# EAGLE design LilyPad_Protoboard_Large (EAGLE 7.2.0)
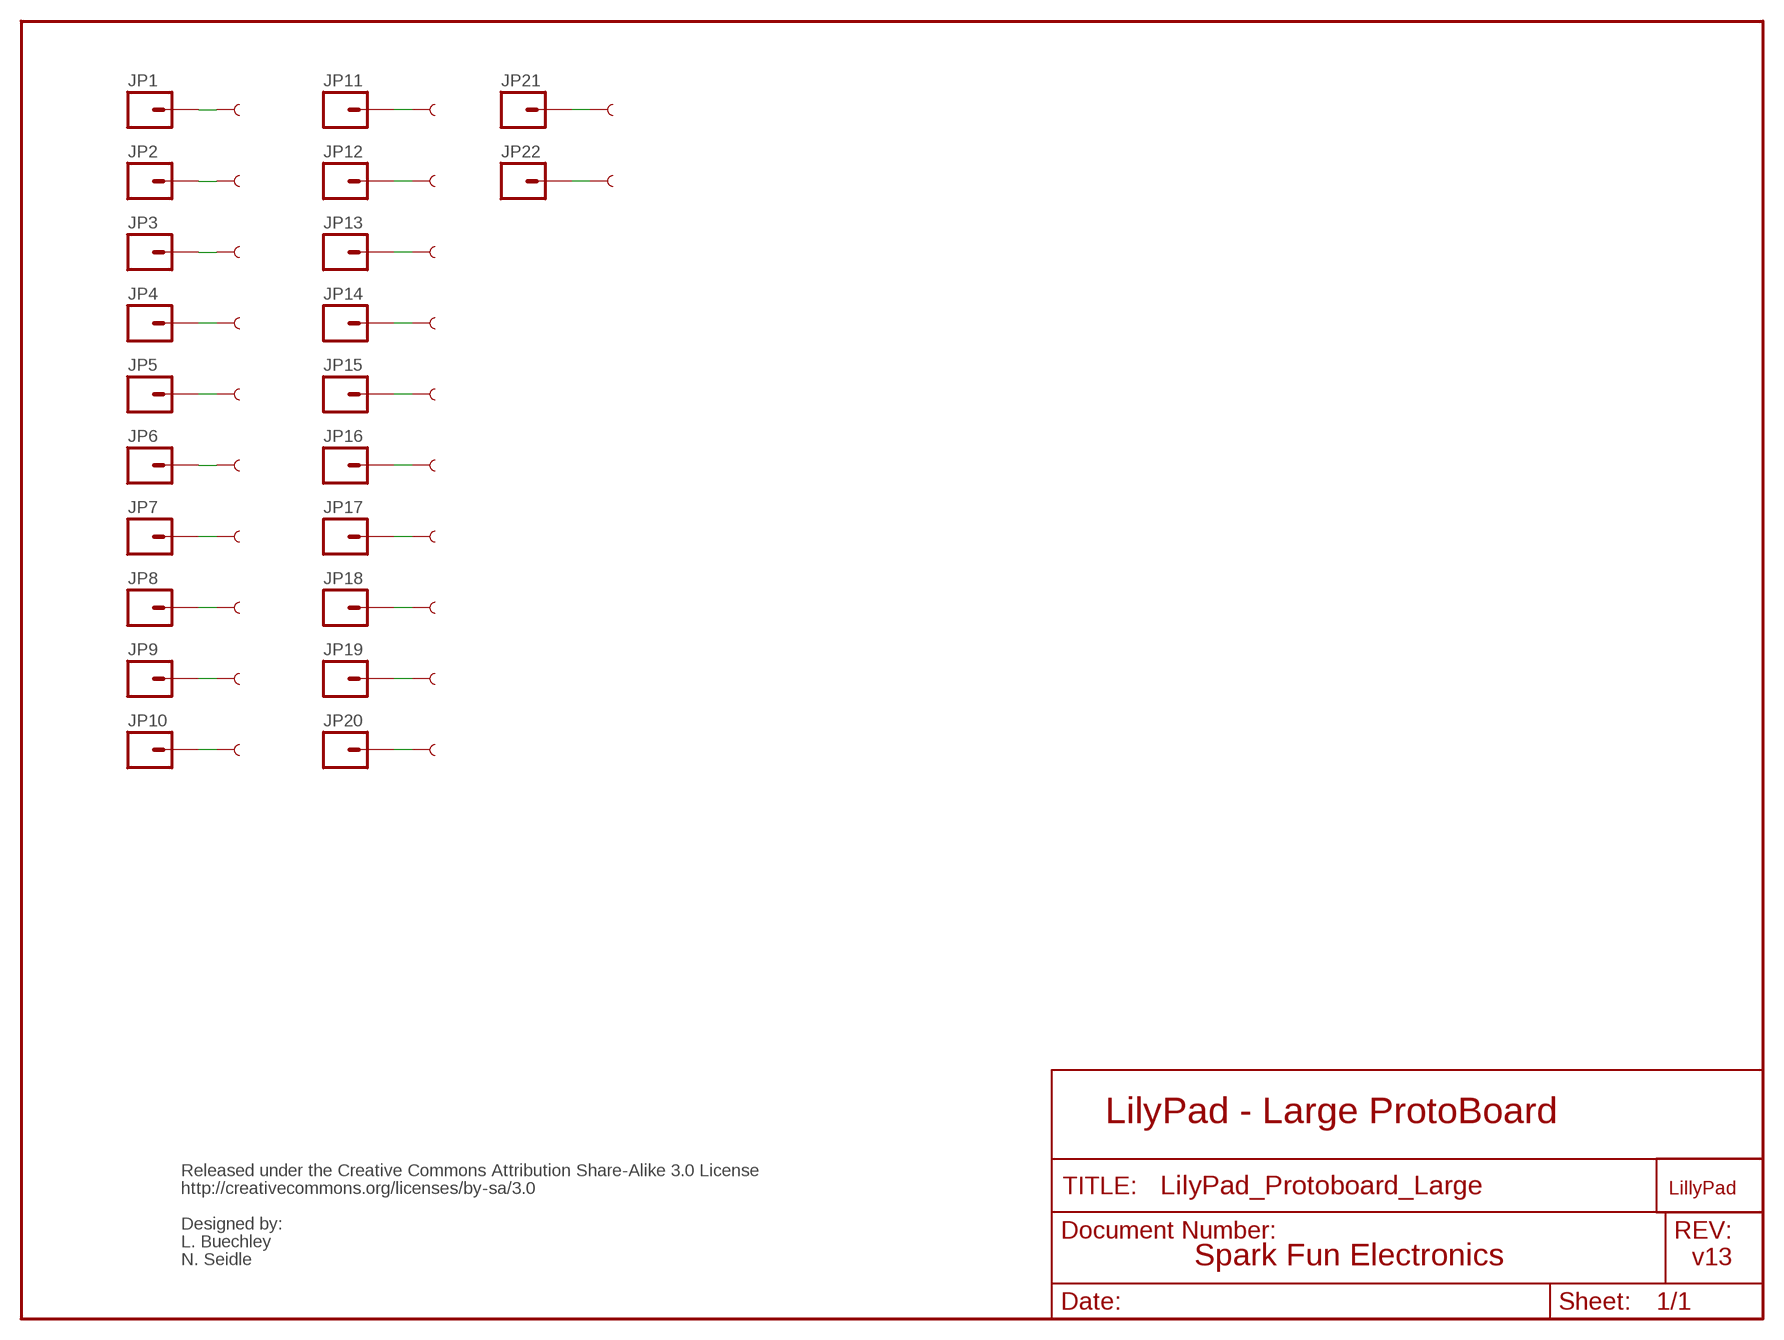
[diagram p0: schematic, sheet 1]

## Parts
GND  SEWTAP9  [PETAL-LONG-1-2SIDE]
JP1  M01SMDNS  [1X01NS]
JP2  M01SMDNS  [1X01NS]
JP3  M01SMDNS  [1X01NS]
JP4  M01SMDNS  [1X01NS]
JP5  M01SMDNS  [1X01NS]
JP6  M01SMDNS  [1X01NS]
JP7  M01SMDNS  [1X01NS]
JP8  M01SMDNS  [1X01NS]
JP9  M01SMDNS  [1X01NS]
JP10  M01SMDNS  [1X01NS]
JP11  M01SMDNS  [1X01NS]
JP12  M01SMDNS  [1X01NS]
JP13  M01SMDNS  [1X01NS]
JP14  M01SMDNS  [1X01NS]
JP15  M01SMDNS  [1X01NS]
JP16  M01SMDNS  [1X01NS]
JP17  M01SMDNS  [1X01NS]
JP18  M01SMDNS  [1X01NS]
JP19  M01SMDNS  [1X01NS]
JP20  M01SMDNS  [1X01NS]
JP21  M01SMDNS  [1X01NS]
JP22  M01SMDNS  [1X01NS]
U$2  LOGO-LPL  [LOGO-L]
U$4  SEWTAP9  [PETAL-LONG-1-2SIDE]
U$30  SEWTAP9  [PETAL-LONG-1-2SIDE]
U$31  SEWTAP9  [PETAL-LONG-1-2SIDE]
U$32  SEWTAP9  [PETAL-LONG-1-2SIDE]
U$33  SEWTAP9  [PETAL-LONG-1-2SIDE]
U$34  SEWTAP9  [PETAL-LONG-1-2SIDE]
U$35  SEWTAP9  [PETAL-LONG-1-2SIDE]
U$36  SEWTAP9  [PETAL-LONG-1-2SIDE]
U$37  SEWTAP9  [PETAL-LONG-1-2SIDE]
U$38  SEWTAP9  [PETAL-LONG-1-2SIDE]
U$39  SEWTAP9  [PETAL-LONG-1-2SIDE]
U$40  SEWTAP9  [PETAL-LONG-1-2SIDE]
U$41  SEWTAP9  [PETAL-LONG-1-2SIDE]
U$42  SEWTAP9  [PETAL-LONG-1-2SIDE]
U$43  SEWTAP9  [PETAL-LONG-1-2SIDE]
U$44  SEWTAP9  [PETAL-LONG-1-2SIDE]
U$45  SEWTAP9  [PETAL-LONG-1-2SIDE]
U$46  SEWTAP9  [PETAL-LONG-1-2SIDE]
U$47  SEWTAP9  [PETAL-LONG-1-2SIDE]
U$48  SEWTAP9  [PETAL-LONG-1-2SIDE]
U$51  SEWTAP9  [PETAL-LONG-1-2SIDE]

## Nets
ALLNET: GND.1 JP1.1 JP2.1 JP3.1 JP4.1 JP5.1 JP6.1 JP7.1 JP8.1 JP9.1 JP10.1 JP11.1 JP12.1 JP13.1 JP14.1 JP15.1 JP16.1 JP17.1 JP18.1 JP19.1 JP20.1 JP21.1 JP22.1 U$4.1 U$30.1 U$31.1 U$32.1 U$33.1 U$34.1 U$35.1 U$36.1 U$37.1 U$38.1 U$39.1 U$40.1 U$41.1 U$42.1 U$43.1 U$44.1 U$45.1 U$46.1 U$47.1 U$48.1 U$51.1

## Notes on the sheet
- LilyPad - Large ProtoBoard
- Released under the Creative Commons Attribution Share-Alike 3.0 License
- http://creativecommons.org/licenses/by-sa/3.0
- Designed by:
- L. Buechley
- N. Seidle | Spark Fun Electronics | v13

## Library data of the parts
GND U$4 U$30-U$48 U$51 = LilyPad-Wearables:SEWTAP
JP1-JP22 = SparkFun:M01: Header 1 Standard 1-pin 0.1" header. Use with straight break away headers (SKU : PRT-00116), right angle break away headers (PRT-00553), swiss pins (PRT-00743), machine pins (PRT-00117), and female headers (PRT-00115).
U$2 = LilyPad-Wearables:LOGO-LP

## Net classes
0 Default: width 0.203 mm
1 VCC: width 0.305 mm

## Board
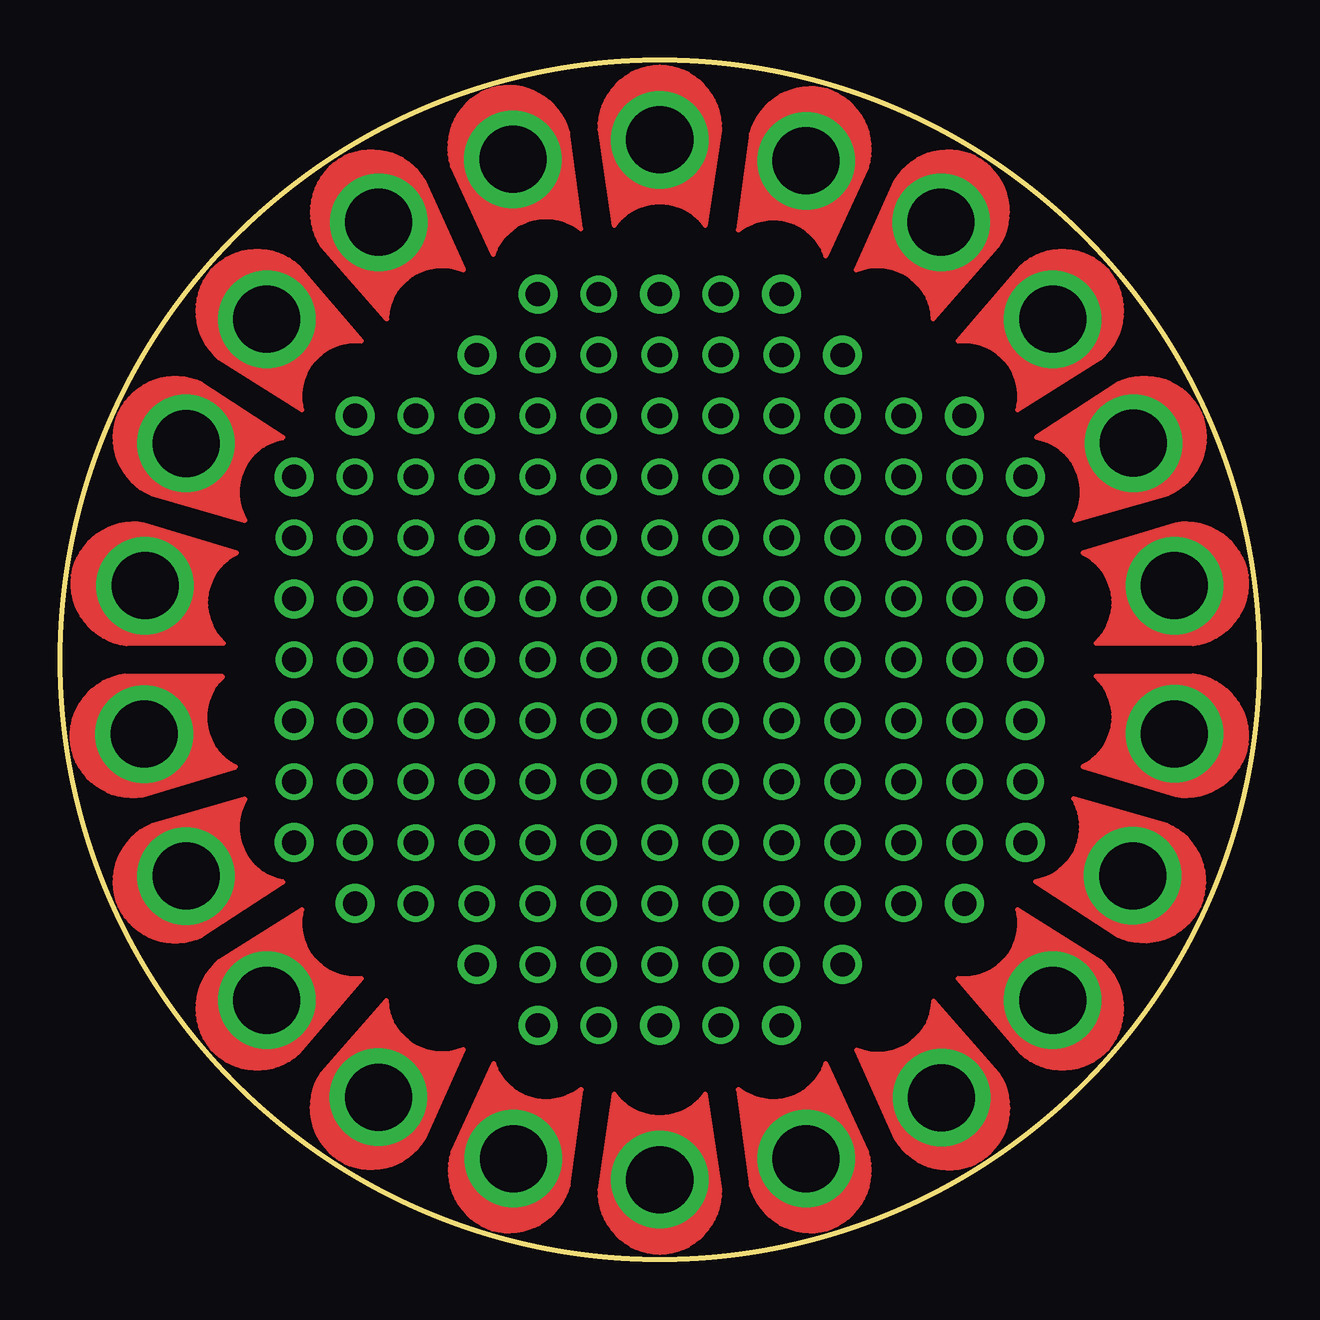
[diagram p1: board, top side]
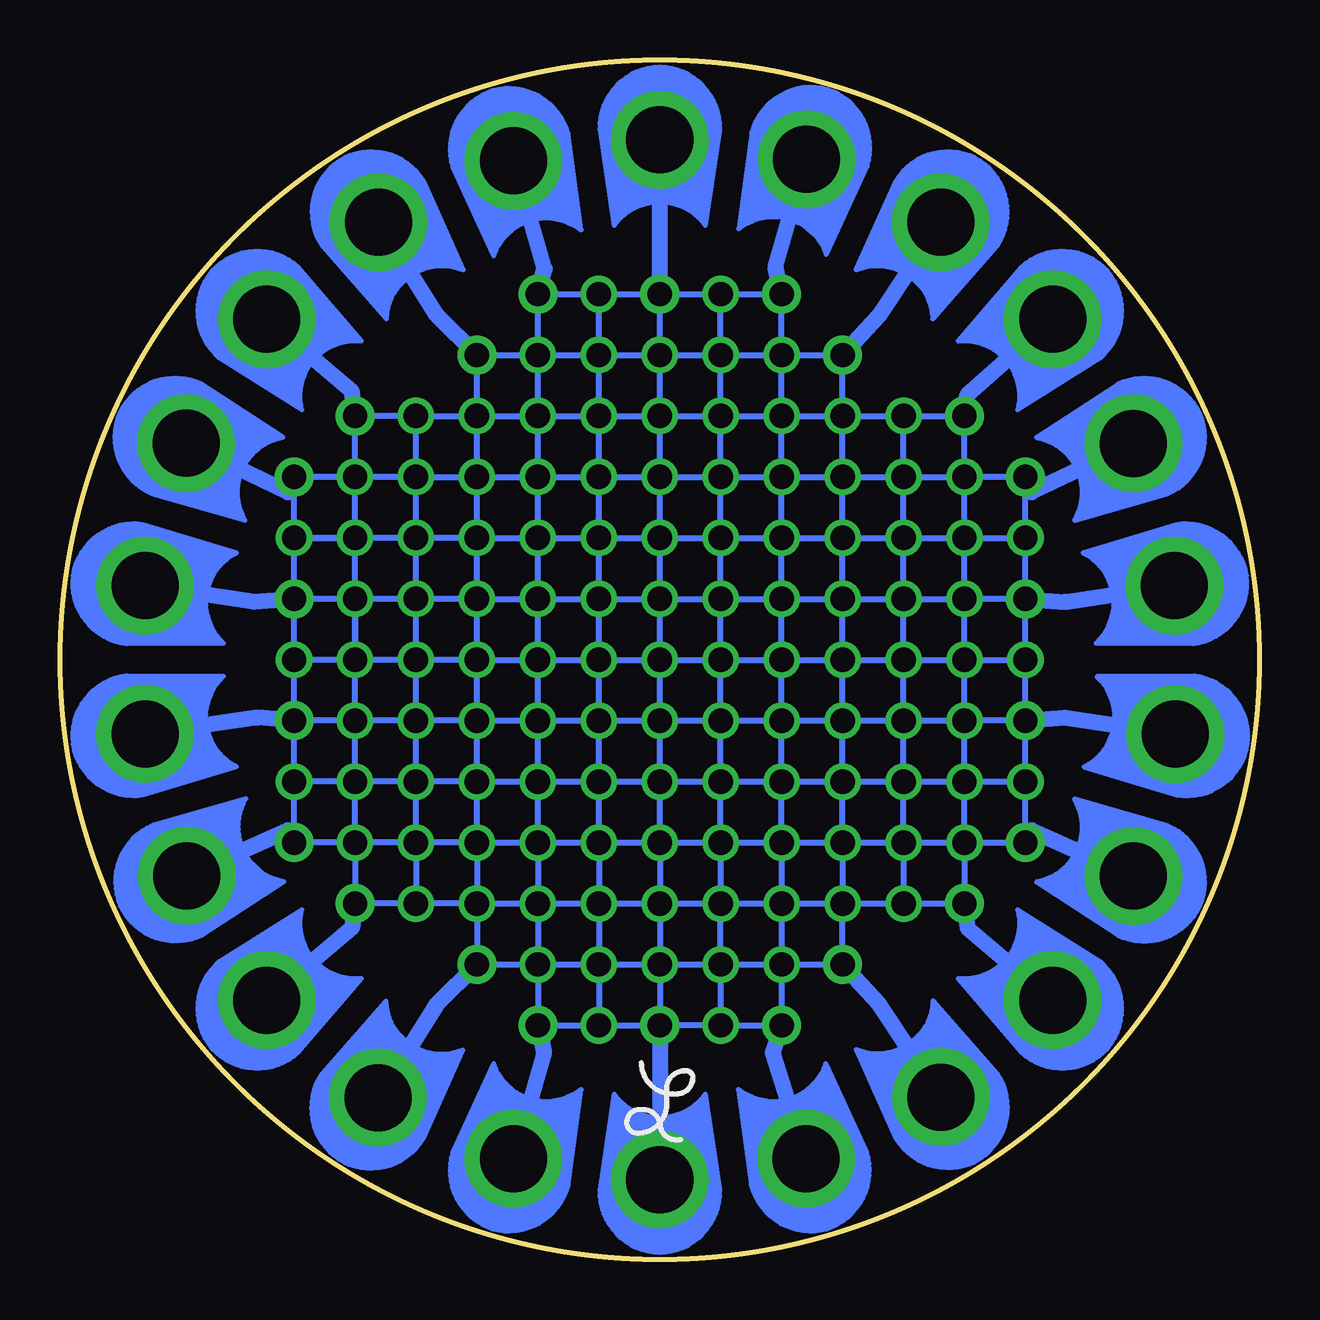
[diagram p2: board, bottom side, seen from below]

Size 50 x 50 mm. Coordinates in mm from the lower left corner, seen from the top.
Outline: circle at 25,25 radius 25
Copper layers (1*16): Top 0.035mm / dielectric 1.5mm / Bottom 0.035mm
Design rules "SparkFun": minimum track width 8mil, minimum drill 20mil, track to track 8mil, track to pad 8mil, pad to pad 8mil, via to via 8mil, smd to smd 8mil, copper to edge 10mil, drill to drill 8mil, minimum pad ring 12mil, minimum via ring 10mil, stop-mask expansion 4mil, vias tented up to drill 25mil, thermal gap 10mil
bRestrict: area 2.4,2.4 to 47.6,47.6; area 21,42.8 to 23.5,44; area 31.6,41.3 to 34.4,43; area 36.3,38.4 to 38.9,40.7; area 40,34.1 to 42,36.9; area 42.2,29.2 to 43.6,31.8; area 42.8,23.9 to 44,26.2; area 42.2,18.2 to 43.7,20.9; area 36.3,9.4 to 39,11.7; area 31.7,7 to 34.5,8.7; area 26.5,6 to 28.9,7.3; area 21.1,6 to 23.6,7.3; area 15.6,7 to 18.3,8.7; area 11,9.3 to 13.8,11.6; area 8,13.1 to 10.1,15.9; area 6.4,18.2 to 8,20.8; area 6,23.7 to 7.2,26.2; area 6.3,29.1 to 7.9,31.7; area 8,34 to 10.1,36.9; area 11,38.3 to 13.7,40.6; area 15.4,41.2 to 18.4,43; area 26.4,42.5 to 29.1,44; area 40,13 to 42,16.1; 22 lines

### Footprints (pad centres in the part's own frame; a part is rotated, then mirrored left to right if it is on the bottom)
PETAL-LONG-1-2SIDE = drill 2.794 pad 4.064: 1 0.03,0
1X01NS = drill 1.016: 1 0,0

### Placement (x,y rotation side)
GND  3.52,28.09 351.8 top
JP1  40.24,22.46 0 top
JP2  40.24,27.54 0 top
JP3  40.24,32.62 0 top
JP4  37.7,35.16 0 top
JP5  32.62,37.7 0 top
JP6  30.08,40.24 0 top
JP7  25,40.24 0 top
JP8  19.92,40.24 0 top
JP9  17.38,37.7 0 top
JP10  12.3,35.16 0 top
JP11  9.76,32.62 0 top
JP12  9.76,17.38 0 top
JP13  12.3,14.84 0 top
JP14  17.38,12.3 0 top
JP15  19.92,9.76 0 top
JP16  25,9.76 0 top
JP17  30.08,9.76 0 top
JP18  32.62,12.3 0 top
JP19  37.7,14.84 0 top
JP20  40.24,17.38 0 top
JP21  9.76,27.54 0 top
JP22  9.76,22.46 0 top
U$2  25,6.59 0 bottom
U$4  46.48,21.91 171.8 top
U$30  46.48,28.09 188.2 top
U$31  44.77,34.04 204.5 top
U$32  41.4,39.21 220.9 top
U$33  36.74,43.26 237.3 top
U$34  31.11,45.83 253.7 top
U$35  18.89,4.17 73.7 top
U$36  25,3.3 90 top
U$37  31.11,4.17 106.3 top
U$38  36.76,6.72 122.7 top
U$39  41.4,10.79 139.1 top
U$40  44.74,15.98 155.5 top
U$41  8.6,10.79 40.9 top
U$42  5.23,15.97 24.5 top
U$43  5.23,34.03 335.5 top
U$44  8.6,39.21 319.1 top
U$45  13.27,43.26 302.7 top
U$46  18.87,45.89 286.3 top
U$47  25,46.7 270 top
U$48  13.26,6.74 57.3 top
U$51  3.48,21.9 8.2 top

### Tracks (layer width: path | path; a pad name or v marks a point on that pad's centre or on a via)
ALLNET  (via drill 1.02)
  Bottom 0.254: v12.3,30.08 v12.3,32.62 | v12.3,30.08 v9.76,30.08 | v14.84,32.62 v14.84,35.16 | v14.84,32.62 v12.3,32.62 | v14.84,32.62 v12.3,32.62 | v22.46,37.7 v22.46,40.24 | v19.92,35.16 v19.92,37.7 | v19.92,35.16 v17.38,35.16 | v17.38,32.62 v17.38,35.16 | v17.38,32.62 v14.84,32.62 | v14.84,30.08 v14.84,32.62 | v14.84,30.08 v12.3,30.08 | v14.84,30.08 v12.3,30.08 | v12.3,27.54 v12.3,30.08 | v12.3,25 v12.3,27.54 | v12.3,25 v9.76,25 | v12.3,25 v12.3,27.54 | v14.84,27.54 v14.84,30.08 | v14.84,27.54 v12.3,27.54 | v14.84,27.54 v14.84,30.08 | v17.38,30.08 v17.38,32.62 | v17.38,30.08 v14.84,30.08 | v17.38,30.08 v14.84,30.08 | v19.92,32.62 v19.92,35.16 | v19.92,32.62 v17.38,32.62 | v19.92,32.62 v17.38,32.62 | v19.92,32.62 v19.92,35.16 | v22.46,35.16 v22.46,37.7 | v22.46,35.16 v19.92,35.16 | v22.46,35.16 v19.92,35.16 | v25,37.7 v22.46,37.7 | v25,37.7 v22.46,37.7 | v25,35.16 v25,37.7 | v25,35.16 v22.46,35.16 | v22.46,32.62 v22.46,35.16 | v22.46,32.62 v19.92,32.62 | v22.46,32.62 v22.46,35.16 | v27.54,37.7 v27.54,40.24 | v27.54,37.7 v25,37.7 | v19.92,30.08 v19.92,32.62 | v19.92,30.08 v17.38,30.08 | v17.38,27.54 v17.38,30.08 | v17.38,27.54 v14.84,27.54 | v14.84,25 v14.84,27.54 | v14.84,25 v12.3,25 | v12.3,22.46 v12.3,25 | v12.3,19.92 v12.3,22.46 | v12.3,19.92 v9.76,19.92 | v14.84,22.46 v14.84,25 | v14.84,22.46 v12.3,22.46 | v14.84,22.46 v14.84,25 | v17.38,25 v17.38,27.54 | v17.38,25 v14.84,25 | v17.38,25 v17.38,27.54 | v19.92,27.54 v19.92,30.08 | v19.92,27.54 v17.38,27.54 | v19.92,27.54 v17.38,27.54 | v30.08,37.7 v27.54,37.7 | v30.08,37.7 v27.54,37.7 | v22.46,30.08 v22.46,32.62 | v22.46,30.08 v19.92,30.08 | v22.46,30.08 v22.46,32.62 | v22.46,30.08 v19.92,30.08 | v25,32.62 v25,35.16 | v25,32.62 v22.46,32.62
  Bottom 0.254: v25,32.62 v25,35.16 | v27.54,35.16 v27.54,37.7 | v27.54,35.16 v25,35.16 | v27.54,35.16 v25,35.16 | v27.54,32.62 v27.54,35.16 | v27.54,32.62 v25,32.62 | v27.54,32.62 v27.54,35.16 | v25,30.08 v25,32.62 | v25,30.08 v22.46,30.08 | v30.08,35.16 v30.08,37.7 | v30.08,35.16 v27.54,35.16 | v22.46,27.54 v22.46,30.08 | v22.46,27.54 v19.92,27.54 | v19.92,25 v19.92,27.54 | v19.92,25 v17.38,25 | v19.92,25 v19.92,27.54 | v17.38,22.46 v17.38,25 | v17.38,22.46 v14.84,22.46 | v12.3,17.38 v12.3,19.92 | v12.3,17.38 v12.3,19.92 | v14.84,19.92 v14.84,22.46 | v14.84,19.92 v12.3,19.92 | v14.84,19.92 v9.76,19.92 | v14.84,19.92 v14.84,22.46 | v14.84,17.38 v14.84,19.92 | v14.84,17.38 v14.84,14.84 | v14.84,17.38 v12.3,17.38 | v14.84,17.38 v12.3,17.38 | v17.38,14.84 v14.84,14.84 | v17.38,14.84 v14.84,14.84 | v17.38,19.92 v17.38,22.46 | v17.38,19.92 v14.84,19.92 | v17.38,19.92 v17.38,22.46 | v19.92,22.46 v19.92,25 | v19.92,22.46 v17.38,22.46 | v22.46,25 v22.46,27.54 | v22.46,25 v19.92,25 | v22.46,25 v22.46,27.54 | v32.62,35.16 v30.08,35.16 | v32.62,35.16 v30.08,35.16 | v25,27.54 v25,30.08 | v25,27.54 v22.46,27.54 | v25,27.54 v22.46,27.54 | v25,27.54 v25,30.08 | v27.54,30.08 v27.54,32.62 | v27.54,30.08 v25,30.08 | v27.54,30.08 v27.54,32.62 | v30.08,32.62 v30.08,35.16 | v30.08,32.62 v27.54,32.62 | v30.08,32.62 v27.54,32.62 | v30.08,32.62 v30.08,35.16 | v40.24,30.08 v37.7,30.08 v35.16,30.08 | v30.08,30.08 v30.08,32.62 | v30.08,30.08 v27.54,30.08 | v27.54,27.54 v27.54,30.08 | v27.54,27.54 v25,27.54 | v27.54,27.54 v25,27.54 | v32.62,32.62 v32.62,35.16 | v32.62,32.62 v30.08,32.62 | v32.62,32.62 v32.62,35.16 | v35.16,35.16 v32.62,35.16 | v25,25 v25,27.54 | v25,25 v22.46,25 | v25,25 v25,27.54 | v22.46,22.46 v22.46,25
  Bottom 0.254: v22.46,22.46 v19.92,22.46 | v17.38,17.38 v17.38,19.92 | v17.38,17.38 v17.38,14.84 | v17.38,17.38 v14.84,17.38 | v17.38,17.38 v14.84,17.38 | v17.38,17.38 v17.38,19.92 | v19.92,14.84 v19.92,12.3 | v19.92,14.84 v17.38,14.84 | v19.92,19.92 v19.92,22.46 | v19.92,19.92 v17.38,19.92 | v19.92,19.92 v19.92,22.46 | v19.92,17.38 v19.92,19.92 | v19.92,17.38 v19.92,14.84 | v19.92,17.38 v17.38,17.38 | v19.92,17.38 v17.38,17.38 | v19.92,17.38 v19.92,19.92 | v22.46,14.84 v19.92,14.84 | v22.46,14.84 v19.92,14.84 | v22.46,19.92 v22.46,22.46 | v22.46,19.92 v19.92,19.92 | v22.46,19.92 v22.46,22.46 | v22.46,12.3 v22.46,14.84 | v22.46,12.3 v22.46,9.76 | v22.46,12.3 v19.92,12.3 | v22.46,12.3 v19.92,12.3 | v25,22.46 v25,25 | v25,22.46 v22.46,22.46 | 38.97,25 v40.24,25 | v35.16,32.62 v35.16,35.16 | v35.16,32.62 v32.62,32.62 | v35.16,32.62 v37.7,32.62 | v35.16,32.62 v32.62,32.62 | v37.7,25 38.97,25 | v27.54,25 v27.54,27.54 | v27.54,25 v25,25 | v30.08,27.54 v30.08,30.08 | v30.08,27.54 v27.54,27.54 | v37.7,27.54 v37.7,25 | v37.7,27.54 v37.7,32.62 | v32.62,30.08 v35.16,30.08 | v32.62,30.08 v32.62,32.62 | v32.62,30.08 v30.08,30.08 | v32.62,30.08 v40.24,30.08 | v32.62,30.08 v30.08,30.08 | v35.16,27.54 v37.7,27.54 | v35.16,27.54 v35.16,30.08 | v32.62,27.54 v35.16,27.54 | v32.62,27.54 v32.62,30.08 | v32.62,27.54 v32.62,30.08 | v32.62,27.54 v37.7,27.54 | v32.62,27.54 v30.08,27.54 | v32.62,27.54 v30.08,27.54 | v30.08,25 v30.08,27.54 | v30.08,25 v27.54,25 | v30.08,25 v27.54,25 | v35.16,25 v37.7,25 | v35.16,25 v35.16,27.54 | v35.16,25 v35.16,32.62 | v35.16,25 38.97,25 | v27.54,22.46 v27.54,25 | v27.54,22.46 v25,22.46 | v27.54,12.3 v27.54,9.76 | v27.54,12.3 v25,12.3 | v25,12.3 v22.46,12.3 | v22.46,17.38 v22.46,19.92
  Bottom 0.254: v22.46,17.38 v22.46,14.84 | v22.46,17.38 v19.92,17.38 | v22.46,17.38 v19.92,17.38 | v22.46,17.38 v22.46,19.92 | v25,14.84 v25,12.3 | v25,14.84 v22.46,14.84 | v25,14.84 v22.46,14.84 | v25,19.92 v25,22.46 | v25,19.92 v22.46,19.92 | v25,19.92 v25,22.46 | v37.7,22.46 v37.7,25 | v37.7,22.46 v37.7,27.54 | v37.7,19.92 v40.24,19.92 | v37.7,19.92 v37.7,22.46 | v37.7,19.92 v37.7,22.46 | v37.7,19.92 v40.24,19.92 | v25,17.38 v25,19.92 | v25,17.38 v25,14.84 | v25,17.38 v22.46,17.38 | v25,17.38 v22.46,17.38 | v25,17.38 v25,19.92 | v27.54,14.84 v27.54,12.3 | v27.54,14.84 v25,14.84 | v27.54,14.84 v27.54,12.3 | v27.54,14.84 v25,14.84 | v27.54,19.92 v27.54,22.46 | v27.54,19.92 v25,19.92 | v27.54,19.92 v27.54,22.46 | v35.16,22.46 v35.16,25 | v35.16,22.46 v37.7,22.46 | v35.16,22.46 v35.16,25 | v30.08,22.46 v30.08,25 | v30.08,22.46 v27.54,22.46 | v32.62,25 v32.62,27.54 | v32.62,25 v35.16,25 | v32.62,25 v30.08,25 | v32.62,25 v30.08,25 | v32.62,25 v32.62,27.54 | v32.62,22.46 v32.62,25 | v32.62,22.46 v30.08,22.46 | v32.62,22.46 v35.16,22.46 | v32.62,22.46 v30.08,22.46 | v32.62,22.46 v32.62,25 | v27.54,17.38 v27.54,19.92 | v27.54,17.38 v27.54,14.84 | v27.54,17.38 v25,17.38 | v27.54,17.38 v25,17.38 | v27.54,17.38 v27.54,19.92 | v30.08,14.84 v30.08,12.3 | v30.08,14.84 v27.54,14.84 | v30.08,14.84 v27.54,14.84 | v30.08,19.92 v30.08,22.46 | v30.08,19.92 v27.54,19.92 | v30.08,19.92 v30.08,22.46 | v37.7,17.38 v37.7,19.92 | v35.16,19.92 v35.16,22.46 | v35.16,19.92 v37.7,19.92 | v35.16,19.92 v37.7,19.92 | v35.16,17.38 v35.16,19.92 | v35.16,17.38 v35.16,14.84 | v35.16,17.38 v37.7,17.38 | v35.16,17.38 v35.16,14.84 | v30.08,17.38 v30.08,19.92 | v30.08,17.38 v30.08,14.84 | v30.08,17.38 v27.54,17.38 | v30.08,17.38 v27.54,17.38
  Bottom 0.254: v32.62,14.84 v35.16,14.84 | v32.62,14.84 v30.08,14.84 | v32.62,19.92 v32.62,22.46 | v32.62,19.92 v30.08,19.92 | v32.62,19.92 v35.16,19.92 | v32.62,19.92 v32.62,22.46 | v32.62,17.38 v32.62,19.92 | v32.62,17.38 v32.62,14.84 | v32.62,17.38 v30.08,17.38 | v32.62,17.38 v35.16,17.38 | v32.62,17.38 v32.62,14.84 | v30.08,12.3 v27.54,12.3 | v17.38,35.16 v14.84,35.16 | v22.46,37.7 v19.92,37.7 | v14.84,14.84 JP13.1 v12.3,17.38 | v17.38,14.84 JP14.1 v19.92,12.3 | v19.92,12.3 JP15.1 v22.46,9.76 | v22.46,9.76 JP16.1 | v27.54,9.76 JP16.1 | v27.54,9.76 JP17.1 v30.08,12.3 | v30.08,12.3 JP18.1 v32.62,14.84 | v37.7,17.38 JP19.1 v35.16,14.84 | v37.7,17.38 JP20.1 v40.24,19.92 | v40.24,19.92 JP1.1 | v37.7,22.46 JP1.1 | JP1.1 v40.24,25 | v40.24,25 JP2.1 | v37.7,27.54 JP2.1 | JP2.1 v40.24,30.08 | v40.24,30.08 JP3.1 v37.7,32.62 | v37.7,32.62 JP4.1 v35.16,35.16 | v32.62,35.16 JP5.1 v30.08,37.7 | v30.08,37.7 JP6.1 v27.54,40.24 | v27.54,40.24 JP7.1 | v25,37.7 JP7.1 | JP7.1 v22.46,40.24 | v22.46,40.24 JP8.1 v19.92,37.7 | v19.92,37.7 JP9.1 v17.38,35.16 | v14.84,35.16 JP10.1 v12.3,32.62 | v12.3,32.62 JP11.1 v9.76,30.08 | JP21.1 v9.76,30.08 | JP21.1 v12.3,27.54 | v9.76,25 JP21.1 | JP22.1 v9.76,25 | JP22.1 v12.3,22.46 | v9.76,19.92 JP22.1 | v9.76,19.92 JP12.1 v12.3,17.38 | v25,12.3 JP16.1
  Bottom 0.66: U$42.1 9.51,17.89 JP12.1 | U$4.1 41.76,22.59 JP1.1 | U$30.1 41.89,27.41 JP2.1 | U$31.1 40.49,31.98 JP3.1 | U$32.1 37.83,36.18 JP4.1 | U$33.1 34.27,39.35 JP5.1 | JP7.1 U$47.1 | U$46.1 20.17,41.38 JP8.1 | U$45.1 15.86,39.35 JP9.1 | U$44.1 12.17,36.05 JP10.1 | U$40.1 40.49,17.89 JP20.1 | U$39.1 37.83,13.82 JP19.1 | U$38.1 34.27,10.65 JP18.1 | U$37.1 29.83,8.62 JP17.1 | JP16.1 U$36.1 | U$35.1 20.3,8.62 JP15.1 | U$48.1 15.86,10.65 JP14.1 | U$41.1 12.17,13.82 JP13.1 | U$43.1 9.51,31.98 JP11.1 | GND.1 8.11,27.41 JP21.1 | U$51.1 8.11,22.59 JP22.1 | U$34.1 29.8,41.3 JP6.1

### Text on the board
tPlace: L. Buechley | N. Seidle | Released under the Creative Commons Attribution Share-Alike 3.0 License | http://creativecommons.org/licenses/by-sa/3.0